# Altium project fmc-320-u-a1.PrjPcb
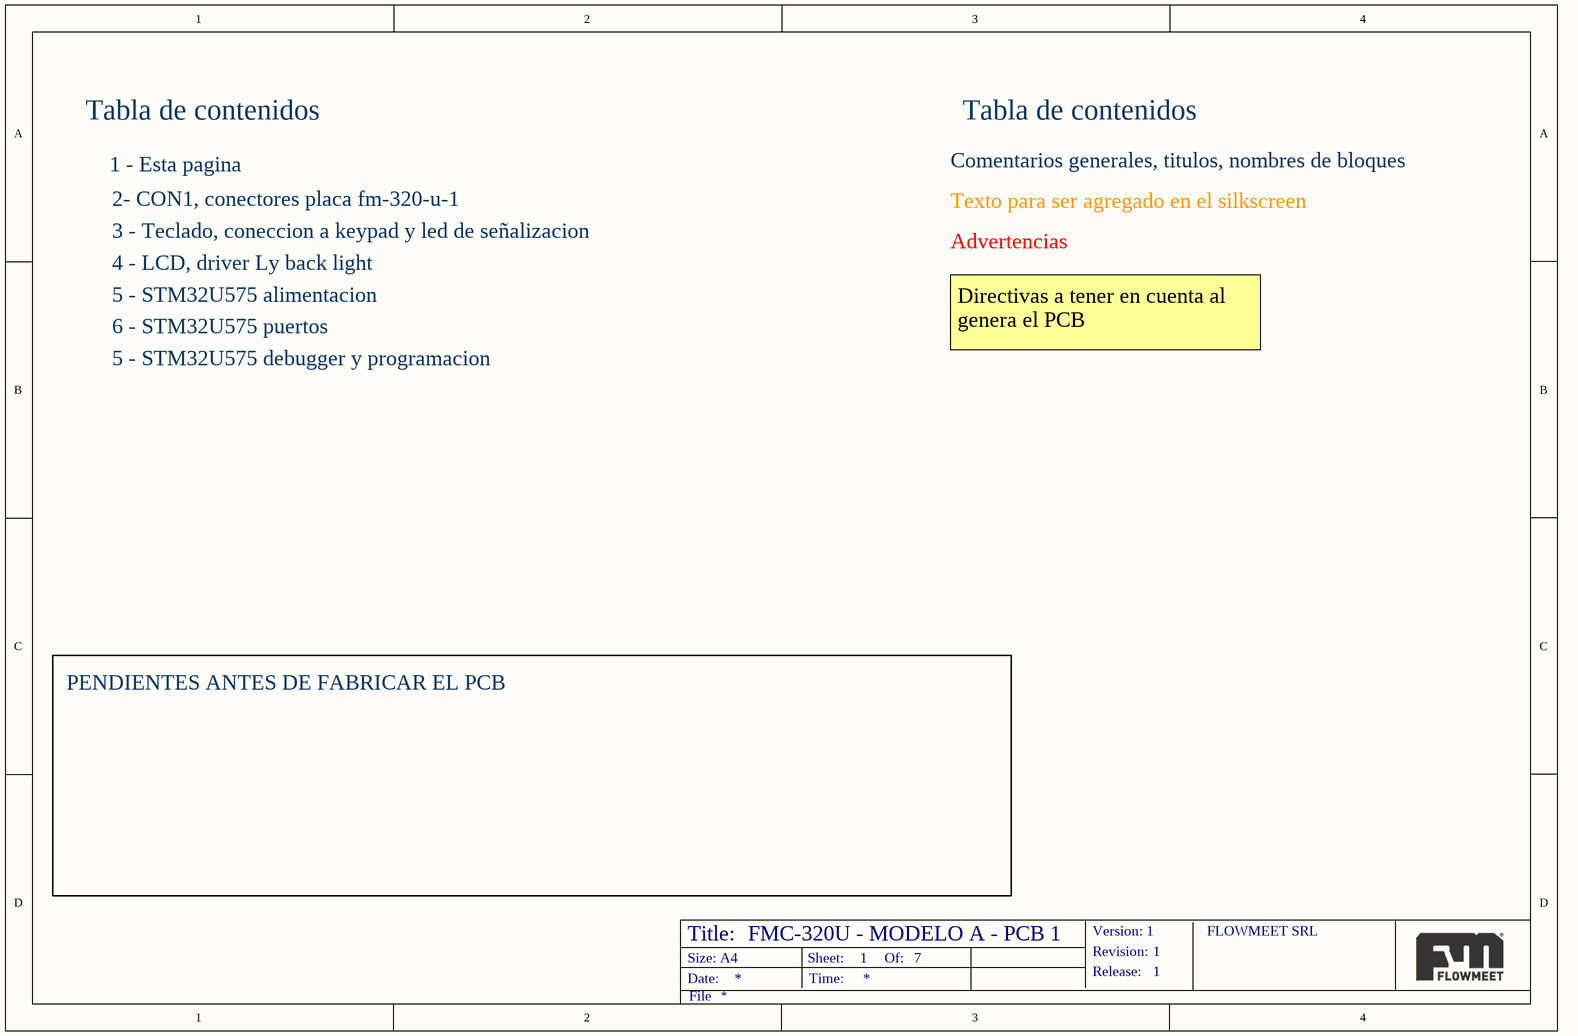
[diagram p0: READ.SchDoc]
7 sheets, 72 parts. Net scope: flat (ports and power ports of the same name join across sheets).
Board file: fmc-320u-a1.PcbDoc
Sheets:
  READ.SchDoc
  CON1.SchDoc
  KEY.SchDoc
  LCD.SchDoc
  MCU_PWR.SchDoc
  MCU_IO.SchDoc
  MCU_DBG.SchDoc

## Sheet READ.SchDoc: FMC-320U - MODELO A - PCB 1
size A4; SheetNumber: 1; SheetTotal: 7; thisVersion: 1; ThisRevision: 1; ThisRelease: 1

### Notes on the sheet
- Tabla de contenidos
- 1 - Esta pagina
- Comentarios generales, titulos, nombres de bloques
- 2- CON1, conectores placa fm-320-u-1
- 3 - Teclado, coneccion a keypad y led de señalizacion
- Texto para ser agregado en el silkscreen
- Advertencias
- 4 - LCD, driver Ly back light
- 5 - STM32U575 alimentacion
- 6 - STM32U575 puertos
- 5 - STM32U575 debugger y programacion
- Directivas a tener en cuenta al genera el PCB
- PENDIENTES ANTES DE FABRICAR EL PCB
- Title:
- Size: A4
- Date:
- Sheet:
- Time:
- Of:
- Version:
- Revision:
- Release:
- FLOWMEET SRL
- File

## Sheet CON1.SchDoc
size A4; SheetNumber: 1; SheetTotal: 6
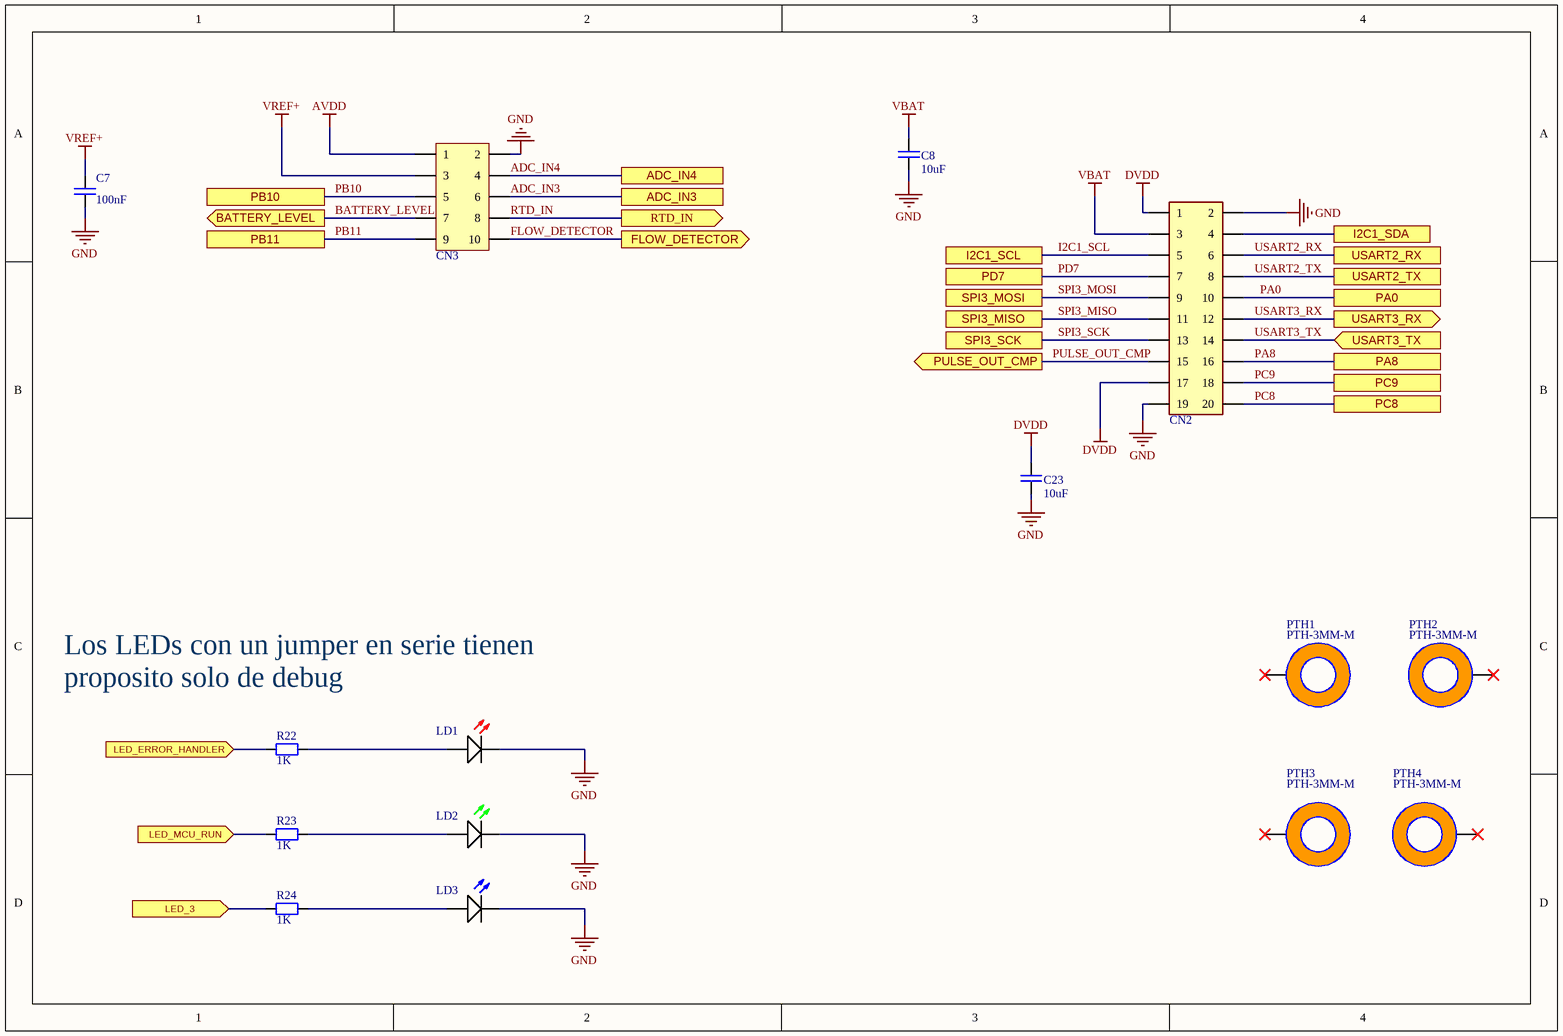
[diagram p1: CON1.SchDoc]

### Parts
C7  100nF  [CAP_SM0805_YAGEOCC2_N]
C8  10uF  [CAP_SM0805_YAGEOCC2_N]
C23  10uF  [CAP_SM0805_YAGEOCC2_N]
CN2  DW254R-22-20-85  [DW254R-22-10-85]  (value not drawn)
CN3  DW254S-22-10-85  [2X5 100 MILS SMD]  (value not drawn)
LD1  RED  [LED 0805]  (value not drawn)
LD2  GREEN  [LED 0805]  (value not drawn)
LD3  BLUE  [LED 0805]  (value not drawn)
PTH1  PTH-3MM-M  [PTH_M3_M]
PTH2  PTH-3MM-M  [PTH_M3_M]
PTH3  PTH-3MM-M  [PTH_M3_M]
PTH4  PTH-3MM-M  [PTH_M3_M]
R22  1K  [RES_SM0805_YAGEORC_N]
R23  1K  [RES_SM0805_YAGEORC_N]
R24  1K  [RES_SM0805_YAGEORC_N]

### Ports
ADC_IN3, ADC_IN4, BATTERY_LEVEL (out), FLOW_DETECTOR (out), I2C1_SCL, I2C1_SDA, LED_3 (in), LED_ERROR_HANDLER (in), LED_MCU_RUN (in), PA0, PA8, PB10, PB11, PC8, PC9, PD7, PULSE_OUT_CMP (out), RTD_IN (out), SPI3_MISO, SPI3_MOSI, SPI3_SCK, USART2_RX, USART2_TX, USART3_RX (out), USART3_TX (in)

### Nets
AVDD: CN3.1
DVDD: C23.2 CN2.1 CN2.17
GND: C7.2 C8.2 C23.1 CN2.2 CN2.19 CN3.2 LD1.K LD2.K LD3.K
VBAT: C8.1 CN2.3
VREF+: C7.1 CN3.3
ADC_IN3: CN3.6 ; port ADC_IN3
ADC_IN4: CN3.4 ; port ADC_IN4
BATTERY_LEVEL: CN3.7 ; port BATTERY_LEVEL
FLOW_DETECTOR: CN3.10 ; port FLOW_DETECTOR
I2C1_SCL: CN2.5 ; port I2C1_SCL
I2C1_SDA: CN2.4 ; port I2C1_SDA
LED_3: R24.1 ; port LED_3
LED_ERROR_HANDLER: R22.1 ; port LED_ERROR_HANDLER
LED_MCU_RUN: R23.1 ; port LED_MCU_RUN
PA0: CN2.10 ; port PA0
PA8: CN2.16 ; port PA8
PB10: CN3.5 ; port PB10
PB11: CN3.9 ; port PB11
PC8: CN2.20 ; port PC8
PC9: CN2.18 ; port PC9
PD7: CN2.7 ; port PD7
PULSE_OUT_CMP: CN2.15 ; port PULSE_OUT_CMP
RTD_IN: CN3.8 ; port RTD_IN
SPI3_MISO: CN2.11 ; port SPI3_MISO
SPI3_MOSI: CN2.9 ; port SPI3_MOSI
SPI3_SCK: CN2.13 ; port SPI3_SCK
USART2_RX: CN2.6 ; port USART2_RX
USART2_TX: CN2.8 ; port USART2_TX
USART3_RX: CN2.12 ; port USART3_RX
USART3_TX: CN2.14 ; port USART3_TX
NetLD1_A: LD1.A R22.2
NetLD2_A: LD2.A R23.2
NetLD3_A: LD3.A R24.2

Not connected (* = marked no-connect by the designer): PTH1 1*; PTH2 1*; PTH3 1*; PTH4 1*

### Notes on the sheet
- Los LEDs con un jumper en serie tienen proposito solo de debug
- Title:
- Size: A4
- Date:
- Sheet:
- Time:
- Of:
- Version:
- Revision:
- Release:
- FLOWMEET SRL
- File

### Library data of the parts
C7 = CC0805KRX7R9BB104: CAP 100nF SM0805 X7R 50V YAGEO CC2; Tolerance (%): 10; Voltage Rating (Volts): 50; Category: Capacitor; Manufacturer: Yageo; Manufacturer Part Number: CC0805KRX7R9BB104; Package: 0805; Value: 100nF; Supplier Part Number 1: 3019949; Supplier 1: Farnell; ComponentLink1URL: http://www.yageo.com; ComponentLink1Description: Manufacturer Website; Supplier 2: Digi-Key; Supplier Part Number 2: 311-1140-1-ND
C8 C23 = CC0805KKX5R8BB106: CAP 10uF SM0805 X5R 25V YAGEO; Tolerance: 10; Category: Capacitor; Manufacturer: Yageo; Manufacturer Part Number: CC0805KKX5R8BB106; Package: 0805; Value: 10uF; ComponentLink1Description: Manufacturer Website; ComponentLink1URL: http://www.yageo.com
CN2 = DW254R-22-20-85: 2 x 10 - true hole 2.54mm - altura 8.5mm; Manufacturer: Dealon; Category: Header female; Manufacturer Part Number: DW254R-22-20-85
CN3 = DW254S-22-10-85: 2 x 5 - SMD 2.54mm - altura 8.5mm; Manufacturer: Dealon; Category: Header female; Manufacturer Part Number: DW254S-22-10-85; Datasheet: https://datasheet.lcsc.com/lcsc/2209141730_DEALON-DW254S-22-10-85_C5160820.pdf
LD1 = 17-21SYGC/S530-E2/TR8: Manufacturer: Everlight Elec; ComponentLink1Description: Datasheet; ComponentLink1URL: https://datasheet.lcsc.com/lcsc/1808272351_Everlight-Elec-17-21SURC-S530-A2-TR8_C131244.pdf; Manufacturer Part Number: 17-21SYGC/S530-E2/TR8; Category: LED
LD2 = 17-21SURC/S530-A2/TR8: Manufacturer: Everlight Elec; Manufacturer Part Number: 17-21SYGC/S530-E2/TR8; ComponentLink1Description: Datasheet; Category: LED; Datasheet: https://datasheet.lcsc.com/lcsc/1811011222_Everlight-Elec-17-21SYGC-S530-E2-TR8_C73548.pdf
LD3 = 17-21/BHC-XL2M2TY/3T: Manufacturer: Everlight Elec; Manufacturer Part Number: 17-21/BHC-XL2M2TY/3T; Category: LED; Datasheet: https://datasheet.lcsc.com/lcsc/1809192317_Everlight-Elec-17-21-BHC-XL2M2TY-3T_C72035.pdf
PTH1-PTH4 = PTH-3MM-M: Agujero de montaje metalizado roscas M3. Drill de tamaño medio.
R22-R24 = RC0805FR-071KL: RES 1K SM0805 YAGEO RC_L; Power (Watts): 0.125; Resistance (Ohms): 1000; Tolerance (%): 1; Category: Resistor; Manufacturer: Yageo; Manufacturer Part Number: RC0805FR-071KL; Package: 0805; Value: 1K; Supplier Part Number 1: 9237496; Supplier 1: Farnell; ComponentLink1URL: http://www.yageo.com; ComponentLink1Description: Manufacturer Website; Supplier 2: Digi-Key; Supplier Part Number 2: 311-1.00KCRCT-ND

## Sheet KEY.SchDoc: FMC-320U-A-01
size A4; =address1: Author: DHS; Approved By: ???; Checked By: ???; Address1fd: L3, 12a Rodborough Rd; SheetNumber: 1; SheetTotal: 5; thisVersion: 1; thisRelease: 0; thisRevision: 0
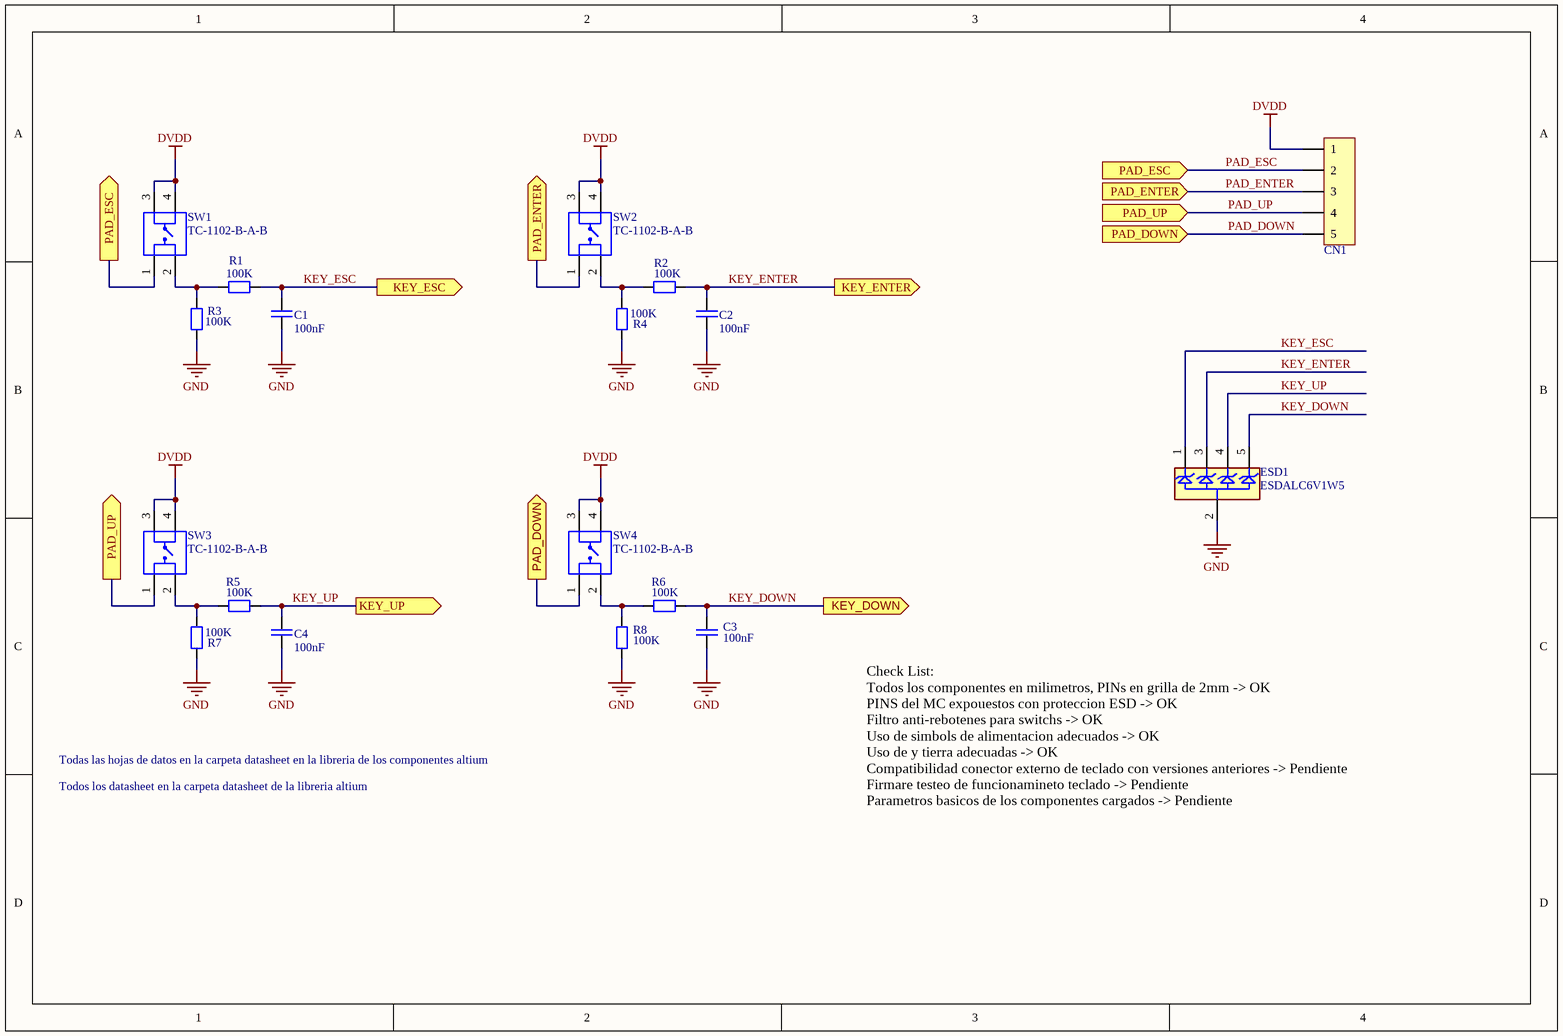
[diagram p2: KEY.SchDoc]

### Parts
C1  100nF  [CAP_SM0805_YAGEOCC2_N]
C2  100nF  [CAP_SM0805_YAGEOCC2_N]
C3  100nF  [CAP_SM0805_YAGEOCC2_N]
C4  100nF  [CAP_SM0805_YAGEOCC2_N]
CN1  54101-T0605LF  [HEADER PIN 1X5]  (value not drawn)
ESD1  ESDALC6V1W5  [ESDALC6V1W5]
R1  100K  [RES_SM0805_YAGEORC_N]
R2  100K  [RES_SM0805_YAGEORC_N]
R3  100K  [RES_SM0805_YAGEORC_N]
R4  100K  [RES_SM0805_YAGEORC_N]
R5  100K  [RES_SM0805_YAGEORC_N]
R6  100K  [RES_SM0805_YAGEORC_N]
R7  100K  [RES_SM0805_YAGEORC_N]
R8  100K  [RES_SM0805_YAGEORC_N]
SW1  TC-1102-B-A-B  [TC-1102-B-A-B]
SW2  TC-1102-B-A-B  [TC-1102-B-A-B]
SW3  TC-1102-B-A-B  [TC-1102-B-A-B]
SW4  TC-1102-B-A-B  [TC-1102-B-A-B]

### Ports
KEY_DOWN (out), KEY_ENTER (out), KEY_ESC (out), KEY_UP (out), PAD_DOWN (in), PAD_DOWN (out), PAD_ENTER (in), PAD_ENTER (out), PAD_ESC (in), PAD_ESC (out), PAD_UP (in), PAD_UP (out)

### Nets
DVDD: CN1.1 SW1.3(g) SW1.4 SW2.3(g) SW2.4 SW3.3(g) SW3.4 SW4.3(g) SW4.4
GND: C1.2 C2.2 C3.2 C4.2 ESD1.2(GND) R3.1 R4.1 R7.1 R8.1
KEY_DOWN: C3.1 ESD1.5(I/04) R6.2 ; port KEY_DOWN
KEY_ENTER: C2.1 ESD1.3(I/02) R2.2 ; port KEY_ENTER
KEY_ESC: C1.1 ESD1.1(I/01) R1.2 ; port KEY_ESC
KEY_UP: C4.1 ESD1.4(I/03) R5.2 ; port KEY_UP
PAD_DOWN: CN1.5 SW4.1 ; port PAD_DOWN
PAD_ENTER: CN1.3 SW2.1 ; port PAD_ENTER
PAD_ESC: CN1.2 SW1.1 ; port PAD_ESC
PAD_UP: CN1.4 SW3.1 ; port PAD_UP
NetR1_1: R1.1 R3.2 SW1.2
NetR2_1: R2.1 R4.2 SW2.2
NetR5_1: R5.1 R7.2 SW3.2
NetR6_1: R6.1 R8.2 SW4.2

### Notes on the sheet
- Todos los datasheet en la carpeta datasheet de la libreria altium
- Todas las hojas de datos en la carpeta datasheet en la libreria de los componentes altium
- Check List:
  Todos los componentes en milimetros, PINs en grilla de 2mm -> OK
  PINS del MC expouestos con proteccion ESD -> OK
  Filtro anti-rebotenes para switchs -> OK
  Uso de simbols de alimentacion adecuados -> OK
  Uso de y tierra adecuadas -> OK
  Compatibilidad conector externo de teclado con versiones anteriores -> Pendiente
  Firmare testeo de funcionamineto teclado -> Pendiente
  Parametros basicos de los componentes cargados -> Pendiente
- Title:
- Size: A4
- Date:
- Sheet:
- Time:
- Of:
- Version:
- Revision:
- Release:
- FLOWMEET SRL
- File

### Library data of the parts
C1-C4 = CC0805KRX7R8BB104: CAP 100nF SM0805 X7R 25V YAGEO CC2; Tolerance (%): 10; Voltage Rating (Volts): 25; Category: Capacitor; Manufacturer: Yageo; Manufacturer Part Number: CC0805KRX7R8BB104; Package: 0805; Value: 100nF; Supplier Part Number 1: 644249; Supplier 1: Farnell; ComponentLink1URL: http://www.yageo.com; ComponentLink1Description: Manufacturer Website; Supplier 2: Digi-Key; Supplier Part Number 2: 311-1141-1-ND
CN1 = 54101-T0605LF: 1 x 5 - true hole  2.54mm - Pb free; Manufacturer: Amphenol ICC; Manufacturer Part Number: 54101-T0605LF; Category: Header pin; Datasheet: https://datasheet.lcsc.com/lcsc/2202082130_Amphenol-ICC-54101-T06-00_C213463.pdf
ESD1 = ESDALC6V1W5: TVS Diode Array Uni-Directional 6.1V / QTY 5 per pack, SOT-323 / Ranking 5: / Marca reconocida. / Usado en placas nucleo, sometidas a manipuleo nunca note un pin quemado por ESD.; Manufacturer: ST; ComponentLink1Description: Datasheet; ComponentLink1URL: *; Manufacturer Part Number: ESDALC6V1W5; Category: Diodo; Datasheet: https://www.st.com/content/ccc/resource/technical/document/datasheet/32/30/02/e6/ac/0f/46/c2/CD00002946.pdf/files/CD00002946.pdf/jcr:content/translations/en.CD00002946.pdf
R1-R8 = RC0805FR-07100KL: RES 100K SM0805 YAGEO RC_L; Power (Watts): 0.125; Resistance (Ohms): 100000; Tolerance (%): 1; Category: Resistor; Manufacturer: Yageo; Manufacturer Part Number: RC0805FR-07100KL; Package: 0805; Value: 100K; Supplier Part Number 1: 9237879; Supplier 1: Farnell; ComponentLink1Description: Manufacturer Website; ComponentLink1URL: http://www.yageo.com; Supplier 2: Digi-Key; Supplier Part Number 2: 311-100KCRCT-ND
SW1-SW4 = TC-1102-B-A-B: Switch tactile 6x6mm true hole.; Manufacturer: XKB Connectivity; Category: Mechanical Switch; Manufacturer Part Number: TC-1102-B-A-B; Datasheet: https://datasheet.lcsc.com/lcsc/2110111230_XKB-Connectivity-TC-1102-B-A-B_C480281.pdf

## Sheet LCD.SchDoc
size A4; Organization: Altium Limited; Address1: L3, 12a Rodborough Rd; Address2: Frenchs Forest; Address3: NSW; Address4: Australia 2086; SheetNumber: 2; SheetTotal: 5
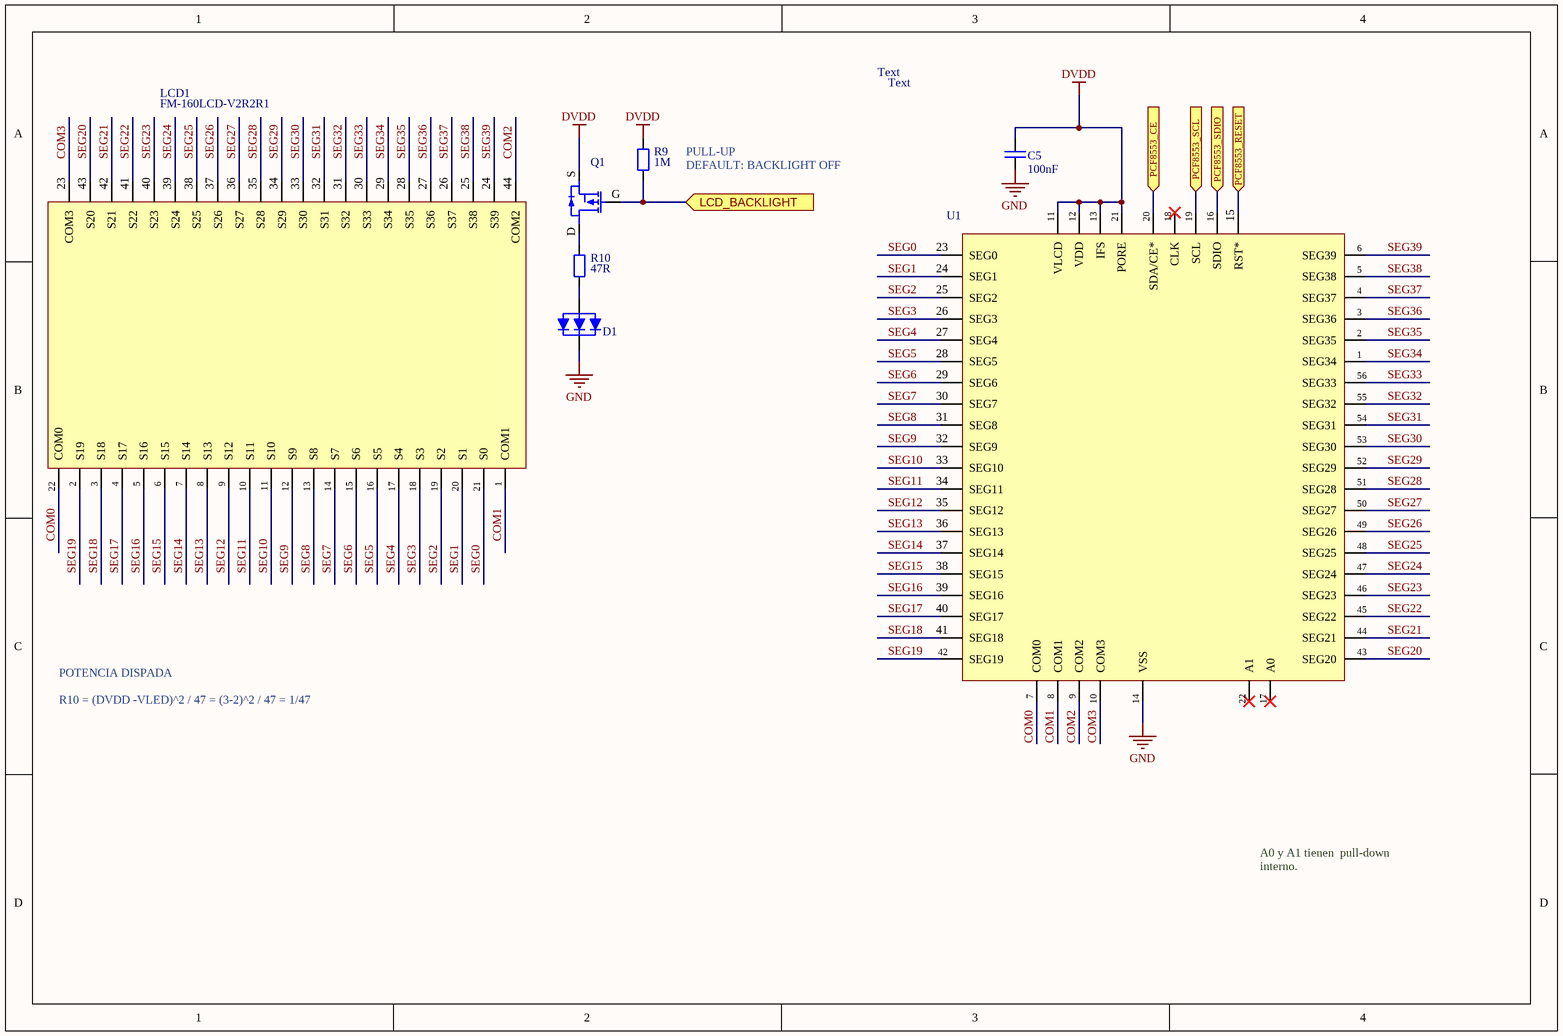
[diagram p3: LCD.SchDoc]

### Parts
C5  100nF  [CAP_SM0805_YAGEOCC2_N]
D1  BACKLIGHT  [BACKLIGHT]  (value not drawn)  (no BOM)
LCD1  FM-160LCD-V2R2R1  [FMC-160LCD V2]
Q1  DMG3401LSN-7  [DMG3401LSN-7]  (value not drawn)
R9  1M  [RES_SM0805_YAGEORC_N]
R10  47R  [RES_SM0805_YAGEORC_N]
U1  PCF8553DTT/AY  [LCD DRIVER - TSSOP56]  (value not drawn)

### Ports
LCD_BACKLIGHT (in), PCF8553_CE (in), PCF8553_RESET (in), PCF8553_SCL (in), PCF8553_SDIO (in)

### Nets
DVDD: C5.1 Q1.S R9.2 U1.11(VLCD) U1.12(VDD) U1.13(IFS) U1.21(PORE)
GND: C5.2 D1.2 U1.14(VSS)
COM0: LCD1.22(COM0) U1.7(COM0)
COM1: LCD1.1(COM1) U1.8(COM1)
COM2: LCD1.44(COM2) U1.9(COM2)
COM3: LCD1.23(COM3) U1.10(COM3)
LCD_BACKLIGTH: Q1.G R9.1 ; port LCD_BACKLIGHT
PCF8553_CE: U1.20(SDA/CE*) ; port PCF8553_CE
PCF8553_RESET: U1.15(RST*) ; port PCF8553_RESET
PCF8553_SCL: U1.19(SCL) ; port PCF8553_SCL
PCF8553_SDIO: U1.16(SDIO) ; port PCF8553_SDIO
SEG0: LCD1.21(S0) U1.23(SEG0)
SEG1: LCD1.20(S1) U1.24(SEG1)
SEG2: LCD1.19(S2) U1.25(SEG2)
SEG3: LCD1.18(S3) U1.26(SEG3)
SEG4: LCD1.17(S4) U1.27(SEG4)
SEG5: LCD1.16(S5) U1.28(SEG5)
SEG6: LCD1.15(S6) U1.29(SEG6)
SEG7: LCD1.14(S7) U1.30(SEG7)
SEG8: LCD1.13(S8) U1.31(SEG8)
SEG9: LCD1.12(S9) U1.32(SEG9)
SEG10: LCD1.11(S10) U1.33(SEG10)
SEG11: LCD1.10(S11) U1.34(SEG11)
SEG12: LCD1.9(S12) U1.35(SEG12)
SEG13: LCD1.8(S13) U1.36(SEG13)
SEG14: LCD1.7(S14) U1.37(SEG14)
SEG15: LCD1.6(S15) U1.38(SEG15)
SEG16: LCD1.5(S16) U1.39(SEG16)
SEG17: LCD1.4(S17) U1.40(SEG17)
SEG18: LCD1.3(S18) U1.41(SEG18)
SEG19: LCD1.2(S19) U1.42(SEG19)
SEG20: LCD1.43(S20) U1.43(SEG20)
SEG21: LCD1.42(S21) U1.44(SEG21)
SEG22: LCD1.41(S22) U1.45(SEG22)
SEG23: LCD1.40(S23) U1.46(SEG23)
SEG24: LCD1.39(S24) U1.47(SEG24)
SEG25: LCD1.38(S25) U1.48(SEG25)
SEG26: LCD1.37(S26) U1.49(SEG26)
SEG27: LCD1.36(S27) U1.50(SEG27)
SEG28: LCD1.35(S28) U1.51(SEG28)
SEG29: LCD1.34(S29) U1.52(SEG29)
SEG30: LCD1.33(S30) U1.53(SEG30)
SEG31: LCD1.32(S31) U1.54(SEG31)
SEG32: LCD1.31(S32) U1.55(SEG32)
SEG33: LCD1.30(S33) U1.56(SEG33)
SEG34: LCD1.29(S34) U1.1(SEG34)
SEG35: LCD1.28(S35) U1.2(SEG35)
SEG36: LCD1.27(S36) U1.3(SEG36)
SEG37: LCD1.26(S37) U1.4(SEG37)
SEG38: LCD1.25(S38) U1.5(SEG38)
SEG39: LCD1.24(S39) U1.6(SEG39)
NetD1_1: D1.1 R10.1
NetQ1_D: Q1.D R10.2

Not connected (* = marked no-connect by the designer): U1 17(A0)* 18(CLK)* 22(A1)*

### Notes on the sheet
- Text
- (near R9) PULL-UP
  DEFAULT: BACKLIGHT OFF
- POTENCIA DISPADA
  R10 = (DVDD -VLED)^2 / 47 = (3-2)^2 / 47 = 1/47
- A0 y A1 tienen  pull-down interno.
- Title:
- Size: A4
- Date:
- FMC-320U MODEL A
- Sheet:
- Time:
- Of:
- Version:
- Revision:
- Release:
- 1
- 0
- FLOWMEET SRL
- File

### Library data of the parts
C5 = CC0805KRX7R8BB104: as C1 on sheet KEY; Category: Capacitor; Manufacturer: Yageo; Manufacturer Part Number: CC0805KRX7R8BB104; Package: 0805; Value: 100nF; Supplier Part Number 1: 644249; Supplier 1: Farnell; ComponentLink1URL: http://www.yageo.com; ComponentLink1Description: Manufacturer Website; Supplier 2: Digi-Key; Supplier Part Number 2: 311-1141-1-ND
D1 = FM-160-BACKLIGHT: IF=45mA;VF=3V; Manufacturer: FLOWMEET; Manufacturer Part Number: FM-160-BACKLIGHT; Category: Backlight; ComponentLink1Description: Datasheet; ComponentLink1URL: *
LCD1 = FM-160LCD-V2R2R1: Manufacturer: FLOWMEET; Manufacturer Part Number: FM-160LCD-V2R2R1; Category: LCD; ComponentLink1Description: Datasheet; ComponentLink1URL: *
Q1 = DMG3401LSN-7: P-CHANNEL ENHANCEMENT MODE MOSFET / RDS(ON) = 85mΩ @ VGS = -2.5V -> ID -2.7A / V(BR)DDS 30V; Manufacturer: Diodes Incorporated; Category: Transistor mosfet; Manufacturer Part Number: DMG3401LSN-7; Datasheet: https://www.digikey.com/es/products/detail/diodes-incorporated/DMG3401LSN-7/3720138?s=N4IgTCBcDaICIFkDiBmALABgIwBkDKAcgLQDsIAugL5A
R9 = RC0805FR-071ML: RES 1M SM0805 YAGEO RC_L; Power (Watts): 0.125; Resistance (Ohms): 1000000; Tolerance (%): 1; Category: Resistor; Manufacturer: Yageo; Manufacturer Part Number: RC0805FR-071ML; Package: 0805; Value: 1M; Supplier Part Number 1: 9237992; Supplier 1: Farnell; ComponentLink1URL: http://www.yageo.com; ComponentLink1Description: Manufacturer Website; Supplier 2: Digi-Key; Supplier Part Number 2: 311-1.00MCRCT-ND
R10 = RC0805FR-0747RL: RES 47R SM0805 YAGEO RC_L; Power (Watts): 0.125; Resistance (Ohms): 47; Tolerance (%): 1; Category: Resistor; Manufacturer: Yageo; Manufacturer Part Number: RC0805FR-0747RL; Package: 0805; Value: 47R; Supplier Part Number 1: 9237321; Supplier 1: Farnell; ComponentLink1Description: Manufacturer Website; ComponentLink1URL: http://www.yageo.com; Supplier 2: Digi-Key; Supplier Part Number 2: 311-47.0CRCT-ND
U1 = PCF8553DTT/AY: 40 × 4 LCD SEGMENT DRIVER; Manufacturer: NXP; Manufacturer Part Number: PCF8553DTT/AY; Category: *; ComponentLink1Description: datasheet; ComponentLink1URL: https://datasheet.lcsc.com/lcsc/2107141507_NXP-Semicon-PCF8553DTT-AJ_C2653705.pdf

## Sheet MCU_PWR.SchDoc
size A4; Organization: Altium Limited; Address1: L3, 12a Rodborough Rd; Address2: Frenchs Forest; Address3: NSW; Address4: Australia 2086; SheetNumber: 3; SheetTotal: 5
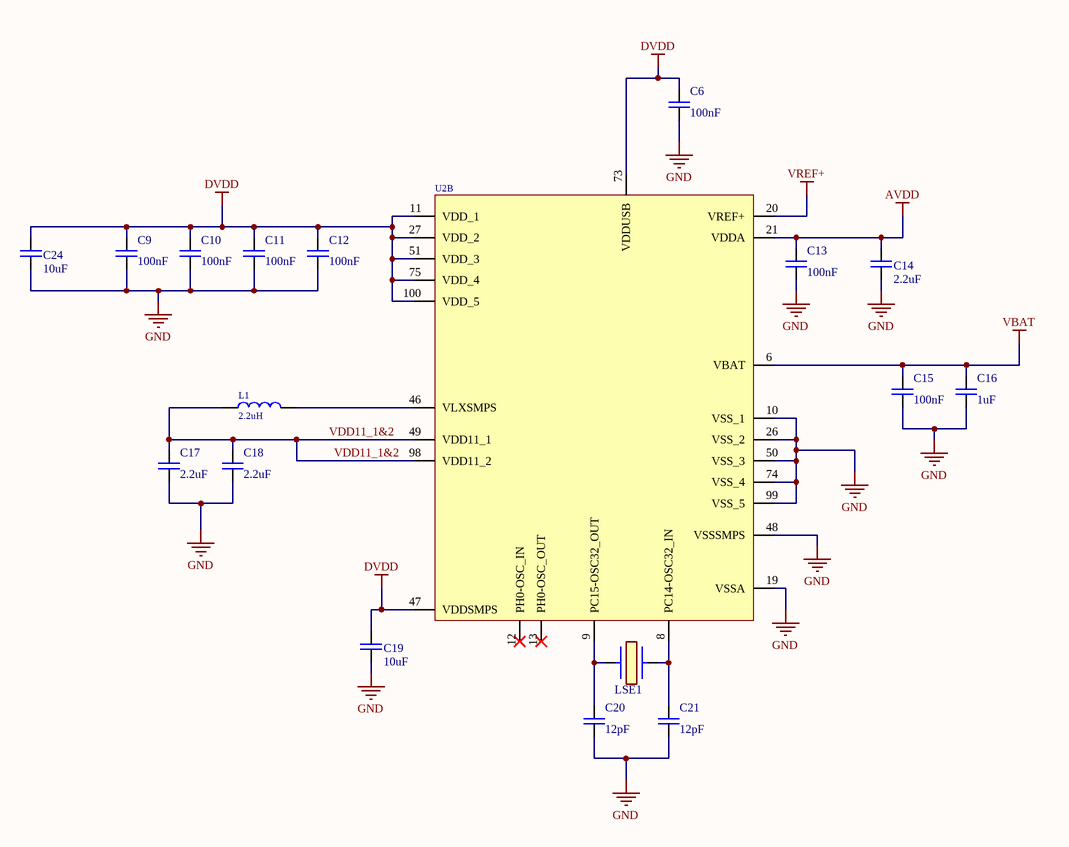
[diagram p4: MCU_PWR.SchDoc]

### Parts
C6  100nF  [CAP_SM0805_YAGEOCC2_N]
C9  100nF  [CAP_SM0805_YAGEOCC2_N]
C10  100nF  [CAP_SM0805_YAGEOCC2_N]
C11  100nF  [CAP_SM0805_YAGEOCC2_N]
C12  100nF  [CAP_SM0805_YAGEOCC2_N]
C13  100nF  [CAP_SM0805_YAGEOCC2_N]
C14  2.2uF  [CAP_SM0805_YAGEOCC2_N]
C15  100nF  [CAP_SM0805_YAGEOCC2_N]
C16  1uF  [CAP_SM0805_YAGEOCC2_N]
C17  2.2uF  [CAP_SM0805_YAGEOCC2_N]
C18  2.2uF  [CAP_SM0805_YAGEOCC2_N]
C19  10uF  [CAP_SM0805_YAGEOCC2_N]
C20  12pF  [CAP_SM0805_YAGEOCC2_N]
C21  12pF  [CAP_SM0805_YAGEOCC2_N]
C24  10uF  [CAP_SM0805_YAGEOCC2_N]
L1  2.2uH  [LQM21PN2R2MGHL]
LSE1  32,768 kHz  [SC-32S32.768kHz20PPM12.5pF]  (value not drawn)
U2  STM32U575VI_1  [STM32U575VI]  (value not drawn)  (part B of 3)

### Nets
AVDD: C13.1 C14.1 U2.21(VDDA)
DVDD: C6.1 C9.1 C10.1 C11.1 C12.1 C19.1 C24.1 U2.11(VDD_1) U2.27(VDD_2) U2.47(VDDSMPS) U2.51(VDD_3) U2.73(VDDUSB) U2.75(VDD_4) U2.100(VDD_5)
GND: C6.2 C9.2 C10.2 C11.2 C12.2 C13.2 C14.2 C15.2 C16.2 C17.2 C18.2 C19.2 C20.2 C21.2 C24.2 U2.10(VSS_1) U2.19(VSSA) U2.26(VSS_2) U2.48(VSSSMPS) U2.50(VSS_3) U2.74(VSS_4) U2.99(VSS_5)
VBAT: C15.1 C16.1 U2.6(VBAT)
VREF+: U2.20(VREF+)
VDD11_1&2: C17.1 C18.1 L1.1 U2.49(VDD11_1) U2.98(VDD11_2)
NetC20_1: C20.1 LSE1.1 U2.9(PC15-OSC32_OUT)
NetC21_1: C21.1 LSE1.2 U2.8(PC14-OSC32_IN)
NetL1_2: L1.2 U2.46(VLXSMPS)

Not connected (* = marked no-connect by the designer): U2 12(PH0-OSC_IN)* 13(PH0-OSC_OUT)*

### Notes on the sheet
- Title:
- Size: A4
- Date:
- FMC-320U MODEL A
- Sheet:
- Time:
- Of:
- Version:
- Revision:
- Release:
- 1
- 0
- FLOWMEET SRL
- File

### Library data of the parts
C6 C9-C13 C15 = CC0805KRX7R9BB104: as C7 on sheet CON1; Category: Capacitor; Manufacturer: Yageo; Manufacturer Part Number: CC0805KRX7R9BB104; Package: 0805; Value: 100nF; Supplier Part Number 1: 3019949; Supplier 1: Farnell; ComponentLink1URL: http://www.yageo.com; ComponentLink1Description: Manufacturer Website; Supplier 2: Digi-Key; Supplier Part Number 2: 311-1140-1-ND
C14 C17 C18 = CC0805KKX7R8BB225: CAP 2u2F SM0805 X7R 25V YAGEO CC2; Tolerance (%): 10; Voltage Rating (Volts): 25; Category: Capacitor; Manufacturer: Yageo; Manufacturer Part Number: CC0805KKX7R8BB225; Package: 0805; Value: 2.2uF; Supplier Part Number 1: 1458904; Supplier 1: Farnell; ComponentLink1URL: http://www.yageo.com; ComponentLink1Description: Manufacturer Website; Supplier 2: Digi-Key
C16 = CC0805KKX7R8BB105: CAP 1uF SM0805 X7R 25V YAGEO CC2; Tolerance (%): 10; Voltage Rating (Volts): 25; Category: Capacitor; Manufacturer: Yageo; Manufacturer Part Number: CC0805KKX7R8BB105; Package: 0805; Value: 1uF; Supplier Part Number 1: 1458903; Supplier 1: Farnell; ComponentLink1URL: http://www.yageo.com; ComponentLink1Description: Manufacturer Website; Supplier 2: Digi-Key; Supplier Part Number 2: 311-1456-1-ND
C19 C24 = CC0805KKX5R8BB106: as C8 on sheet CON1; Category: Capacitor; Manufacturer: Yageo; Manufacturer Part Number: CC0805KKX5R8BB106; Package: 0805; Value: 10uF; ComponentLink1Description: Manufacturer Website; ComponentLink1URL: http://www.yageo.com
C20 C21 = CC0805JRNPO9BN120: CAP 12pF SM0805 NPO 50V YAGEO CC2; Tolerance (%): 5; Voltage Rating (Volts): 50; Category: Capacitor; Manufacturer: Yageo; Manufacturer Part Number: CC0805JRNPO9BN120; Package: 0805; Value: 12pF; ComponentLink1URL: http://www.yageo.com; ComponentLink1Description: Manufacturer Website
L1 = LQM21PN2R2MGHL: Inductores de potencia - SMD 2.2 UH 20%; Manufacturer: Murata Electronics; Manufacturer Part Number: LQM21PN2R2MGHL; Category: Inductor; Value: 2.2uH; Datasheet: https://ar.mouser.com/datasheet/2/281/1/JELF243B_0040-961444.pdf
LSE1 = SC32S-12.5PF20PPM: Cristal Oscilador 32.768 kHz, 12.5pF; Manufacturer: Seiko; Manufacturer Part Number: SC32S-12.5PF20PPM; Category: Cristal Oscilador; Value: 32,768 kHz; Datasheet: https://datasheet.lcsc.com/lcsc/1811151435_Seiko-SC-32S32-768kHz20PPM12-5pF_C97606.pdf
U2 = STM32U575VI_1: Manufacturer: ST; Manufacturer Part Number: STM32U575VIT6Q; Category: Microcontrolador; Datasheet: https://www.st.com/resource/en/datasheet/stm32u575ag.pdf

## Sheet MCU_IO.SchDoc
size A4; Organization: Altium Limited; Address1: L3, 12a Rodborough Rd; Address2: Frenchs Forest; Address3: NSW; Address4: Australia 2086; SheetNumber: 4; SheetTotal: 5
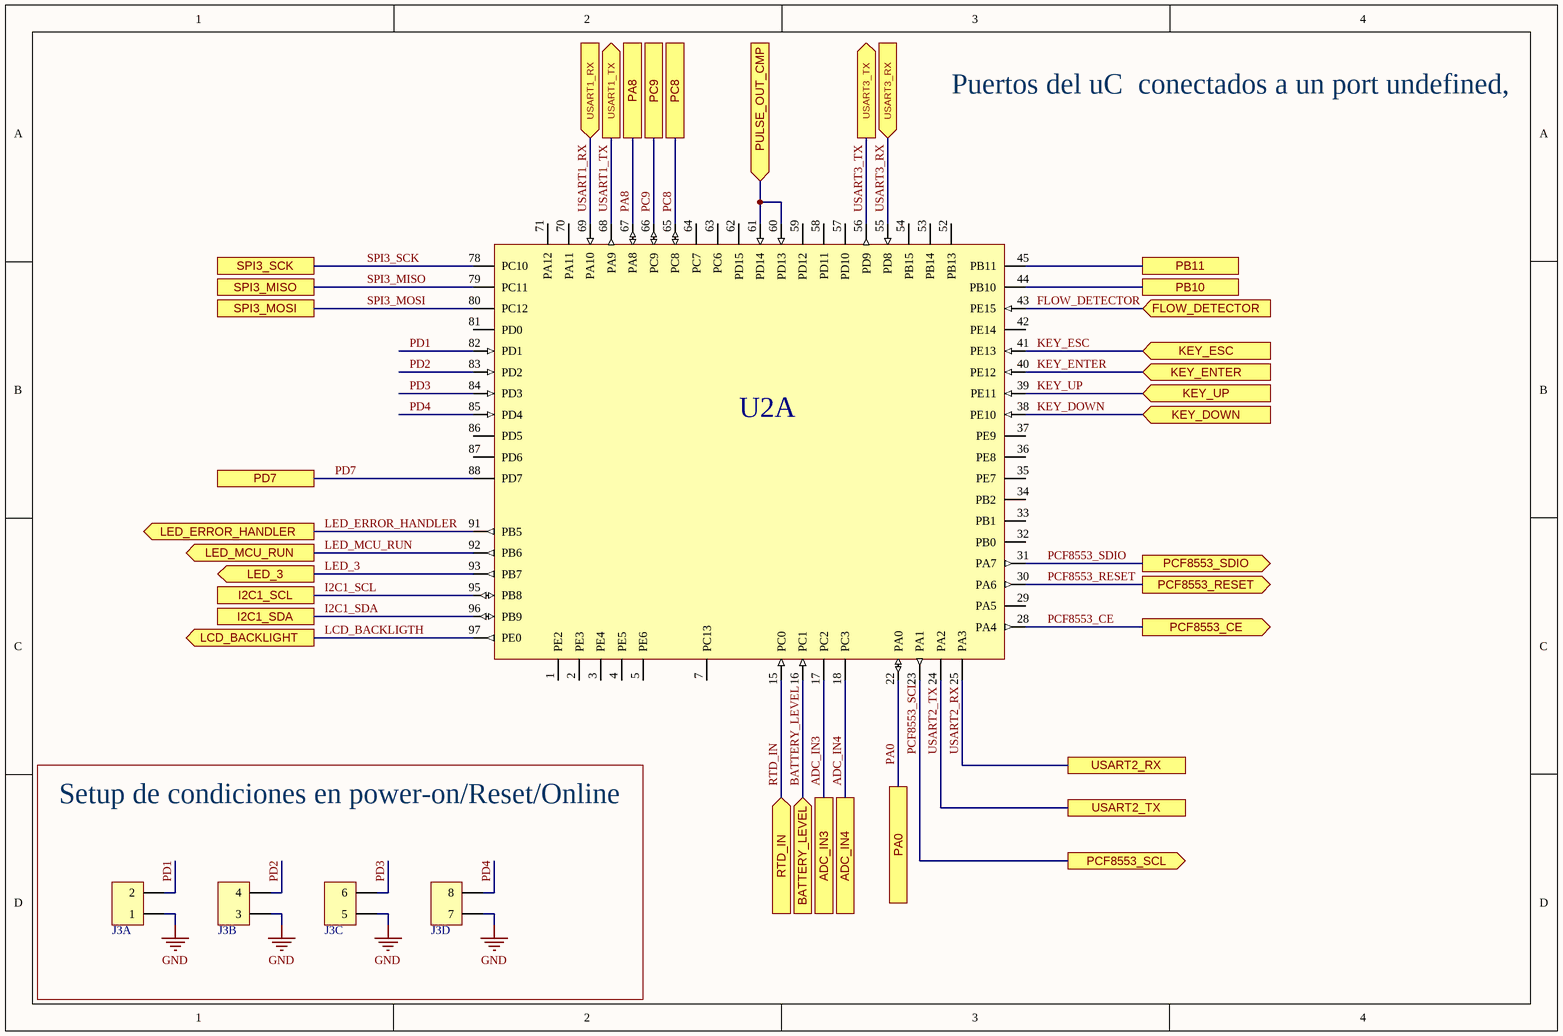
[diagram p5: MCU_IO.SchDoc]

### Parts
J3  B-2100S08P-B110-JUMPER  [HEADER PIN 2X4]  (value not drawn)  (parts A,B,C,D of 4)
U2  STM32U575VI_1  [STM32U575VI]  (value not drawn)  (part A of 3)

### Ports
ADC_IN3, ADC_IN4, BATTERY_LEVEL (in), FLOW_DETECTOR (in), I2C1_SCL, I2C1_SDA, KEY_DOWN (in), KEY_ENTER (in), KEY_ESC (in), KEY_UP (in), LCD_BACKLIGHT (out), LED_3 (out), LED_ERROR_HANDLER (out), LED_MCU_RUN (out), PA0, PA8, PB10, PB11, PC8, PC9, PCF8553_CE (out), PCF8553_RESET (out), PCF8553_SCL (out), PCF8553_SDIO (out), PD7, PULSE_OUT_CMP (in), RTD_IN (in), SPI3_MISO, SPI3_MOSI, SPI3_SCK, USART1_RX (in), USART1_TX (out), USART2_RX, USART2_TX, USART3_RX (in), USART3_TX (out)

### Nets
GND: J3.1 J3.3 J3.5 J3.7
ADC_IN3: U2.17(PC2) ; port ADC_IN3
ADC_IN4: U2.18(PC3) ; port ADC_IN4
BATTERY_LEVEL: U2.16(PC1) ; port BATTERY_LEVEL
FLOW_DETECTOR: U2.43(PE15) ; port FLOW_DETECTOR
I2C1_SCL: U2.95(PB8) ; port I2C1_SCL
I2C1_SDA: U2.96(PB9) ; port I2C1_SDA
KEY_DOWN: U2.38(PE10) ; port KEY_DOWN
KEY_ENTER: U2.40(PE12) ; port KEY_ENTER
KEY_ESC: U2.41(PE13) ; port KEY_ESC
KEY_UP: U2.39(PE11) ; port KEY_UP
LCD_BACKLIGTH: U2.97(PE0) ; port LCD_BACKLIGHT
LED_3: U2.93(PB7) ; port LED_3
LED_ERROR_HANDLER: U2.91(PB5) ; port LED_ERROR_HANDLER
LED_MCU_RUN: U2.92(PB6) ; port LED_MCU_RUN
PA0: U2.22(PA0) ; port PA0
PA8: U2.67(PA8) ; port PA8
PB10: U2.44(PB10) ; port PB10
PB11: U2.45(PB11) ; port PB11
PC8: U2.65(PC8) ; port PC8
PC9: U2.66(PC9) ; port PC9
PCF8553_CE: U2.28(PA4) ; port PCF8553_CE
PCF8553_RESET: U2.30(PA6) ; port PCF8553_RESET
PCF8553_SCL: U2.23(PA1) ; port PCF8553_SCL
PCF8553_SDIO: U2.31(PA7) ; port PCF8553_SDIO
PD1: J3.2 U2.82(PD1)
PD2: J3.4 U2.83(PD2)
PD3: J3.6 U2.84(PD3)
PD4: J3.8 U2.85(PD4)
PD7: U2.88(PD7) ; port PD7
PULSE_OUT_CMP: U2.60(PD13) U2.61(PD14) ; port PULSE_OUT_CMP
RTD_IN: U2.15(PC0) ; port RTD_IN
SPI3_MISO: U2.79(PC11) ; port SPI3_MISO
SPI3_MOSI: U2.80(PC12) ; port SPI3_MOSI
SPI3_SCK: U2.78(PC10) ; port SPI3_SCK
USART1_RX: U2.69(PA10) ; port USART1_RX
USART1_TX: U2.68(PA9) ; port USART1_TX
USART2_RX: U2.25(PA3) ; port USART2_RX
USART2_TX: U2.24(PA2) ; port USART2_TX
USART3_RX: U2.55(PD8) ; port USART3_RX
USART3_TX: U2.56(PD9) ; port USART3_TX

Not connected (* = marked no-connect by the designer): U2 1(PE2) 2(PE3) 3(PE4) 4(PE5) 5(PE6) 7(PC13) 29(PA5) 32(PB0) 33(PB1) 34(PB2) 35(PE7) 36(PE8) 37(PE9) 42(PE14) 52(PB13) 53(PB14) 54(PB15) 57(PD10) 58(PD11) 59(PD12) 62(PD15) 63(PC6) 64(PC7) 70(PA11) 71(PA12) 81(PD0) 86(PD5) 87(PD6)

### Notes on the sheet
- Puertos del uC  conectados a un port undefined, tienen funcion sugerida  pero no definida.
- (near J3) Setup de condiciones en power-on/Reset/Online
- Title:
- Size: A4
- Date:
- FMC-320U MODEL A
- Sheet:
- Time:
- Of:
- Version:
- Revision:
- Release:
- 1
- 0
- FLOWMEET SRL
- File

### Library data of the parts
J3 = B-2100S08P-B110-JUMPER: 2 x 4 - true hole  2.54mm; Manufacturer: Ckmtw; Manufacturer Part Number: B-2100S08P-B110; Category: Header pin; Datasheet: https://datasheet.lcsc.com/lcsc/2304140030_Ckmtw-Shenzhen-Cankemeng-B-2100S08P-B110_C124386.pdf
U2 = STM32U575VI_1: as U2 on sheet MCU_PWR; Category: Microcontrolador; Datasheet: https://www.st.com/resource/en/datasheet/stm32u575ag.pdf

## Sheet MCU_DBG.SchDoc
size A4; Organization: Altium Limited; Address1: L3, 12a Rodborough Rd; Address2: Frenchs Forest; Address3: NSW; Address4: Australia 2086; SheetNumber: 5; SheetTotal: 5
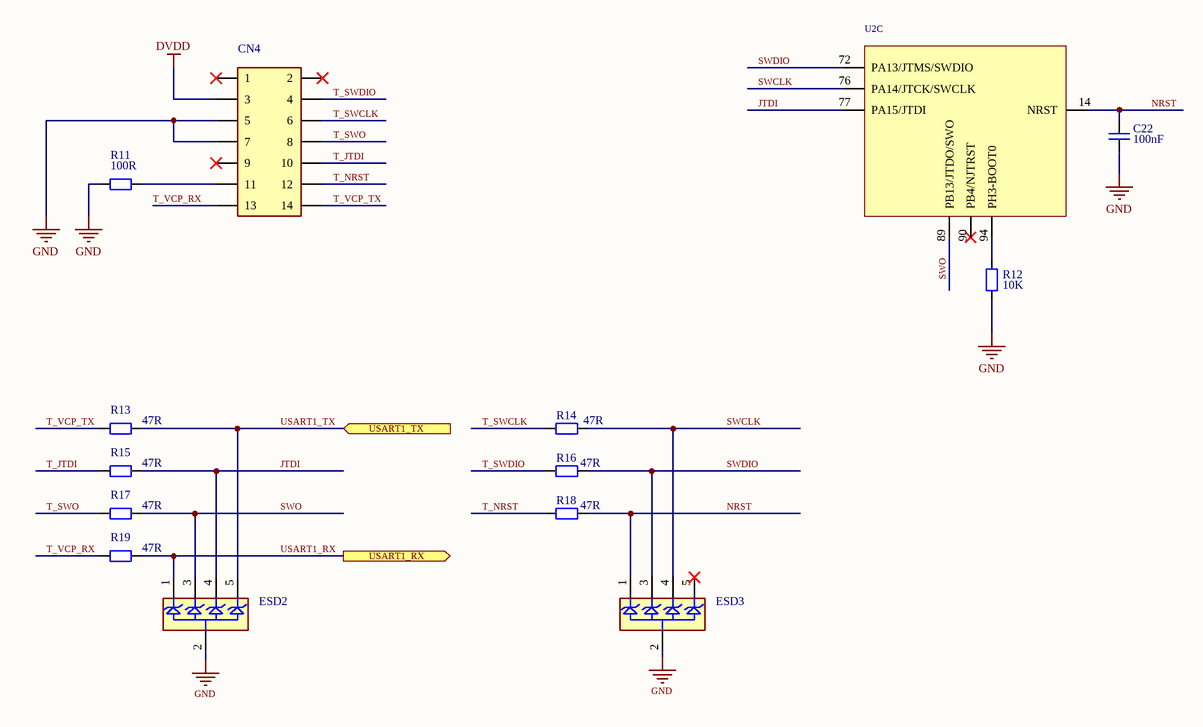
[diagram p6: MCU_DBG.SchDoc]

### Parts
C22  100nF  [CAP_SM0805_YAGEOCC2_N]
CN4  20021511-00014T4LF  [2002151100014T4LF]  (value not drawn)
ESD2  ESDALC6V1W5  [ESDALC6V1W5]  (value not drawn)
ESD3  ESDALC6V1W5  [ESDALC6V1W5]  (value not drawn)
R11  100R  [RES_SM0805_YAGEORC_N]
R12  10K  [RES_SM0805_YAGEORC_N]
R13  47R  [RES_SM0805_YAGEORC_N]
R14  47R  [RES_SM0805_YAGEORC_N]
R15  47R  [RES_SM0805_YAGEORC_N]
R16  47R  [RES_SM0805_YAGEORC_N]
R17  47R  [RES_SM0805_YAGEORC_N]
R18  47R  [RES_SM0805_YAGEORC_N]
R19  47R  [RES_SM0805_YAGEORC_N]
U2  STM32U575VI_1  [STM32U575VI]  (value not drawn)  (part C of 3)

### Ports
USART1_RX (out), USART1_TX (in)

### Nets
DVDD: CN4.3
GND: C22.2 CN4.5 CN4.7 ESD2.2(GND) ESD3.2(GND) R11.1 R12.1
JTDI: ESD2.4(I/03) R15.2 U2.77(PA15/JTDI)
NRST: C22.1 ESD3.1(I/01) R18.2 U2.14(NRST)
SWCLK: ESD3.4(I/03) R14.2 U2.76(PA14/JTCK/SWCLK)
SWDIO: ESD3.3(I/02) R16.2 U2.72(PA13/JTMS/SWDIO)
SWO: ESD2.3(I/02) R17.2 U2.89(PB13/JTDO/SWO)
T_JTDI: CN4.10 R15.1
T_NRST: CN4.12 R18.1
T_SWCLK: CN4.6 R14.1
T_SWDIO: CN4.4 R16.1
T_SWO: CN4.8 R17.1
T_VCP_RX: CN4.13 R19.1
T_VCP_TX: CN4.14 R13.1
USART1_RX: ESD2.1(I/01) R19.2 ; port USART1_RX
USART1_TX: ESD2.5(I/04) R13.2 ; port USART1_TX
NetCN4_11: CN4.11 R11.2
NetR12_2: R12.2 U2.94(PH3-BOOT0)

Not connected (* = marked no-connect by the designer): CN4 1* 2* 9*; ESD3 5(I/04)*; U2 90(PB4/NJTRST)*

### Notes on the sheet
- Title:
- Size: A4
- Date:
- FMC-320U MODEL A
- Sheet:
- Time:
- Of:
- Version:
- Revision:
- Release:
- 1
- 0
- FLOWMEET SRL
- File

### Library data of the parts
C22 = CC0805KRX7R9BB104: as C7 on sheet CON1; Category: Capacitor; Manufacturer: Yageo; Manufacturer Part Number: CC0805KRX7R9BB104; Package: 0805; Value: 100nF; Supplier Part Number 1: 3019949; Supplier 1: Farnell; ComponentLink1URL: http://www.yageo.com; ComponentLink1Description: Manufacturer Website; Supplier 2: Digi-Key; Supplier Part Number 2: 311-1140-1-ND
CN4 = 20021511-00014T4LF: 1.27mm (0.05in.) pitch, Shrouded header, 14 contacts; Manufacturer: Amphenol ICC; Manufacturer Part Number: 20021511-00014T4LF; Category: Header Shrouded; Datasheet: https://cdn.amphenol-cs.com/media/wysiwyg/files/drawing/20021511.pdf
ESD2 ESD3 = ESDALC6V1W5: as ESD1 on sheet KEY; ComponentLink1Description: Datasheet; ComponentLink1URL: *; Manufacturer Part Number: ESDALC6V1W5; Category: Diodo; Datasheet: https://www.st.com/content/ccc/resource/technical/document/datasheet/32/30/02/e6/ac/0f/46/c2/CD00002946.pdf/files/CD00002946.pdf/jcr:content/translations/en.CD00002946.pdf
R11 = RC0805FR-07100RL: RES 100R SM0805 YAGEO RC_L; Power (Watts): 0.125; Resistance (Ohms): 100; Tolerance (%): 1; Category: Resistor; Manufacturer: Yageo; Manufacturer Part Number: RC0805FR-07100RL; Package: 0805; Value: 100R; Supplier Part Number 1: 9237364; Supplier 1: Farnell; ComponentLink1Description: Manufacturer Website; ComponentLink1URL: http://www.yageo.com; Supplier 2: Digi-Key; Supplier Part Number 2: 311-100CRCT-ND
R12 = RC0805FR-0710KL: RES 10K SM0805 YAGEO RC_L; Power (Watts): 0.125; Resistance (Ohms): 10000; Tolerance (%): 1; Category: Resistor; Manufacturer: Yageo; Manufacturer Part Number: RC0805FR-0710KL; Package: 0805; Value: 10K; Supplier Part Number 1: 9237755; Supplier 1: Farnell; ComponentLink1Description: Manufacturer Website; ComponentLink1URL: http://www.yageo.com; Supplier 2: Digi-Key; Supplier Part Number 2: 311-10.0KCRCT-ND
R13-R19 = RC0805FR-0747RL: as R10 on sheet LCD; Category: Resistor; Manufacturer: Yageo; Manufacturer Part Number: RC0805FR-0747RL; Package: 0805; Value: 47R; Supplier Part Number 1: 9237321; Supplier 1: Farnell; ComponentLink1Description: Manufacturer Website; ComponentLink1URL: http://www.yageo.com; Supplier 2: Digi-Key; Supplier Part Number 2: 311-47.0CRCT-ND
U2 = STM32U575VI_1: as U2 on sheet MCU_PWR; Category: Microcontrolador; Datasheet: https://www.st.com/resource/en/datasheet/stm32u575ag.pdf

## Nets that join several sheets
AVDD: CON1 (CN3.1), MCU_PWR (C13.1 C14.1 U2.21)
DVDD: CON1 (C23.2 CN2.1 CN2.17), KEY (9 pins), LCD (7 pins), MCU_PWR (14 pins), MCU_DBG (CN4.3)
GND: CON1 (9 pins), KEY (9 pins), LCD (C5.2 D1.2 U1.14), MCU_PWR (22 pins), MCU_IO (J3.1 J3.3 J3.5 J3.7), MCU_DBG (7 pins)
VBAT: CON1 (C8.1 CN2.3), MCU_PWR (C15.1 C16.1 U2.6)
VREF+: CON1 (C7.1 CN3.3), MCU_PWR (U2.20)
ADC_IN3: CON1 (CN3.6), MCU_IO (U2.17)
ADC_IN4: CON1 (CN3.4), MCU_IO (U2.18)
BATTERY_LEVEL: CON1 (CN3.7), MCU_IO (U2.16)
FLOW_DETECTOR: CON1 (CN3.10), MCU_IO (U2.43)
I2C1_SCL: CON1 (CN2.5), MCU_IO (U2.95)
I2C1_SDA: CON1 (CN2.4), MCU_IO (U2.96)
KEY_DOWN: KEY (C3.1 ESD1.5 R6.2), MCU_IO (U2.38)
KEY_ENTER: KEY (C2.1 ESD1.3 R2.2), MCU_IO (U2.40)
KEY_ESC: KEY (C1.1 ESD1.1 R1.2), MCU_IO (U2.41)
KEY_UP: KEY (C4.1 ESD1.4 R5.2), MCU_IO (U2.39)
LCD_BACKLIGTH: LCD (Q1.G R9.1), MCU_IO (U2.97)
LED_3: CON1 (R24.1), MCU_IO (U2.93)
LED_ERROR_HANDLER: CON1 (R22.1), MCU_IO (U2.91)
LED_MCU_RUN: CON1 (R23.1), MCU_IO (U2.92)
PA0: CON1 (CN2.10), MCU_IO (U2.22)
PA8: CON1 (CN2.16), MCU_IO (U2.67)
PB10: CON1 (CN3.5), MCU_IO (U2.44)
PB11: CON1 (CN3.9), MCU_IO (U2.45)
PC8: CON1 (CN2.20), MCU_IO (U2.65)
PC9: CON1 (CN2.18), MCU_IO (U2.66)
PCF8553_CE: LCD (U1.20), MCU_IO (U2.28)
PCF8553_RESET: LCD (U1.15), MCU_IO (U2.30)
PCF8553_SCL: LCD (U1.19), MCU_IO (U2.23)
PCF8553_SDIO: LCD (U1.16), MCU_IO (U2.31)
PD7: CON1 (CN2.7), MCU_IO (U2.88)
PULSE_OUT_CMP: CON1 (CN2.15), MCU_IO (U2.60 U2.61)
RTD_IN: CON1 (CN3.8), MCU_IO (U2.15)
SPI3_MISO: CON1 (CN2.11), MCU_IO (U2.79)
SPI3_MOSI: CON1 (CN2.9), MCU_IO (U2.80)
SPI3_SCK: CON1 (CN2.13), MCU_IO (U2.78)
USART1_RX: MCU_IO (U2.69), MCU_DBG (ESD2.1 R19.2)
USART1_TX: MCU_IO (U2.68), MCU_DBG (ESD2.5 R13.2)
USART2_RX: CON1 (CN2.6), MCU_IO (U2.25)
USART2_TX: CON1 (CN2.8), MCU_IO (U2.24)
USART3_RX: CON1 (CN2.12), MCU_IO (U2.55)
USART3_TX: CON1 (CN2.14), MCU_IO (U2.56)

## Assembly variants
beta_1: not fitted D1 LCD1